# EAGLE schematic Programmer (EAGLE 7.1.0)
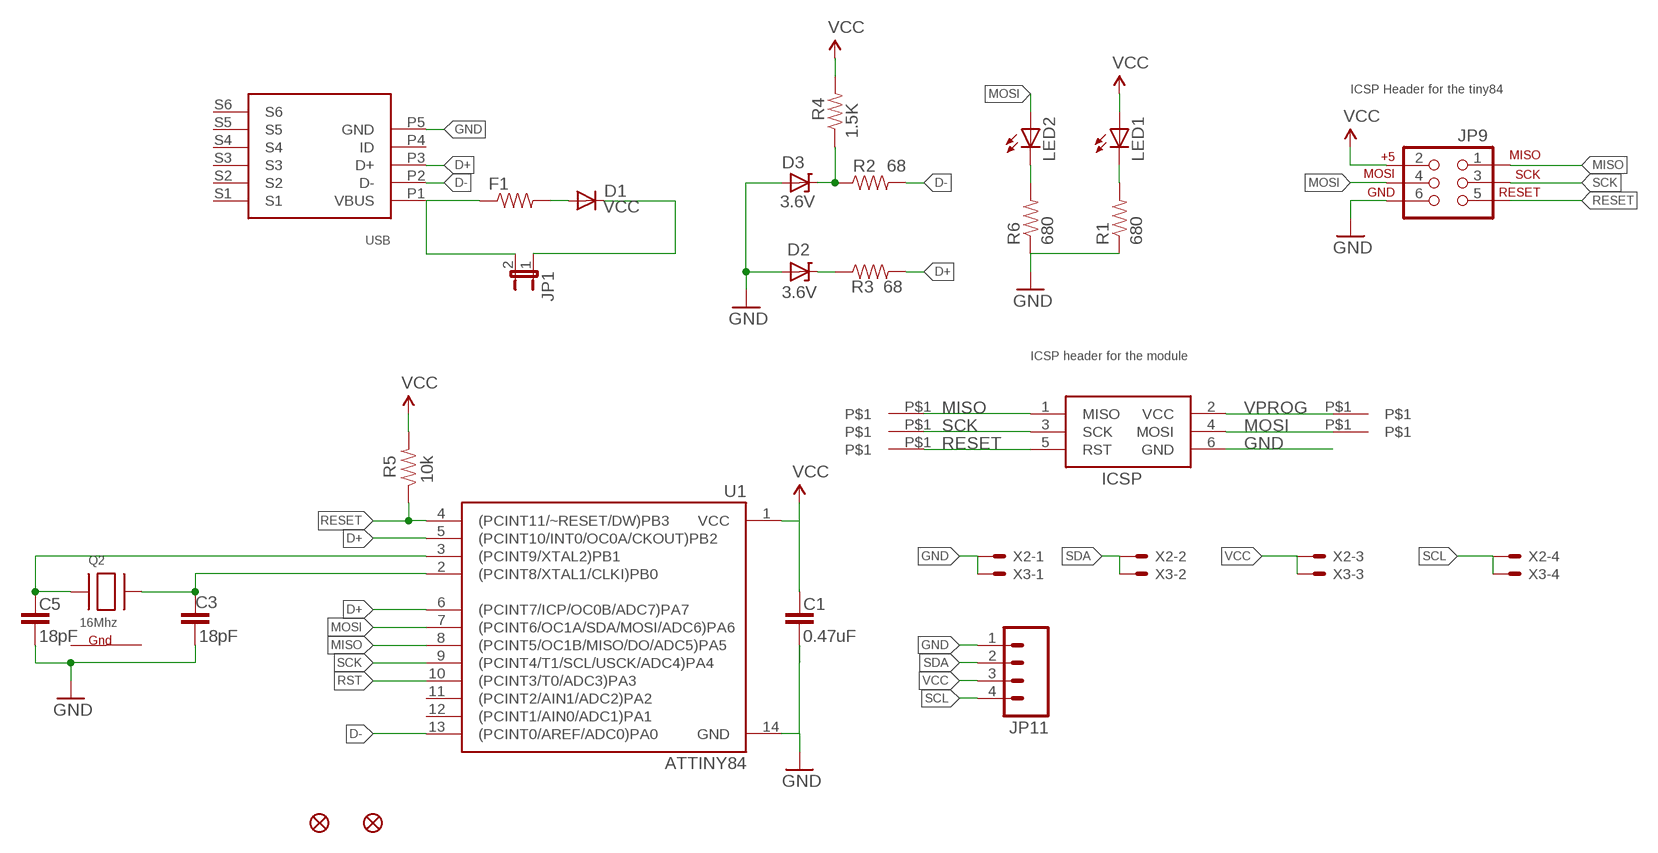
[diagram p0: schematic, sheet 1]

## Parts
C1  0.47uF  CAP0805  [0805]
C3  18pF  CAP0805  [0805]
C5  18pF  CAP0805  [0805]
D1  DIODESMB  [SMB-DIODE]
D2  3.6V  DIODE-ZENER-BZT52  [SOD-323]
D3  3.6V  DIODE-ZENER-BZT52  [SOD-323]
F1  RESISTOR0805-RES  [0805]
ICSP  AVRISP-BOX  [AVRISP-BOX]
JP1  JUMPER-2SMD-NO  [SJ_2S-NO]
JP8  FIDUCIALUFIDUCIAL  [MICRO-FIDUCIAL]
JP9  AVR_SPI_PRG_6PTH  [2X3]
JP10  FIDUCIALUFIDUCIAL  [MICRO-FIDUCIAL]
JP11  M04LOCK  [1X04_LOCK]
LED1  LEDCHIPLED_0805  [CHIPLED_0805]
LED2  LEDCHIPLED_0805  [CHIPLED_0805]
Q2  16Mhz  XTAL-4-3225  [NX3225]
R1  680  RESISTOR0805-RES  [0805]
R2  68  RESISTOR0805-RES  [0805]
R3  68  RESISTOR0805-RES  [0805]
R4  1.5K  RESISTOR0805-RES  [0805]
R5  10k  RESISTOR0402-RES  [0402-RES]
R6  680  RESISTOR0805-RES  [0805]
U1  ATTINY84  [SO14]
U$1  SPRING-CONNECTOR  [SPRING-CONNECTOR]
U$2  SPRING-CONNECTOR  [SPRING-CONNECTOR]
U$15  USBFCI-MICROB  [USB-MICROB-FCI]
U$22  SPRING-CONNECTOR  [SPRING-CONNECTOR]
U$23  SPRING-CONNECTOR  [SPRING-CONNECTOR]
U$24  SPRING-CONNECTOR  [SPRING-CONNECTOR]
X2  C-GRID-04-70543  [70543-04]
X3  C-GRID-04-70543  [70543-04]

## Nets
D+: R3.2 U1.5((PCINT10/INT0/OC0A/CKOUT)PB2) U1.6((PCINT7/ICP/OC0B/ADC7)PA7) U$15.P3(D+)
D-: R2.2 U1.13((PCINT0/AREF/ADC0)PA0) U$15.P2(D-)
GND: C1.2 C3.2 C5.2 D2.2(A) D3.2(A) ICSP.6(GND) JP9.6 JP11.1 R1.1 R6.1 U1.14(GND) U$15.P5(GND) X2.1 X3.1
MISO: ICSP.1(MISO) JP9.1 U1.8((PCINT5/OC1B/MISO/DO/ADC5)PA5) U$1.P$1
MOSI: ICSP.4(MOSI) JP9.4 LED2.A U1.7((PCINT6/OC1A/SDA/MOSI/ADC6)PA6) U$23.P$1
N$1: D1.A F1.2
N$2: LED2.C R6.2
N$3: C5.1 Q2.1(X1) U1.3((PCINT9/XTAL2)PB1)
N$5: F1.1 JP1.2 U$15.P1(VBUS)
N$6: D3.1(C) R2.1 R4.1
N$7: D2.1(C) R3.1
N$9: LED1.C R1.2
N$10: C3.1 Q2.3(X2) U1.2((PCINT8/XTAL1/CLKI)PB0)
RESET: ICSP.5(RST) JP9.5 R5.1 U1.4((PCINT11/~RESET/DW)PB3) U$2.P$1
RST: U1.10((PCINT3/T0/ADC3)PA3)
SCK: ICSP.3(SCK) JP9.3 U1.9((PCINT4/T1/SCL/USCK/ADC4)PA4) U$22.P$1
SCL: JP11.4 X2.4 X3.4
SDA: JP11.2 X2.2 X3.2
VCC: C1.1 D1.C JP1.1 JP9.2 JP11.3 LED1.A R4.2 R5.2 U1.1(VCC) X2.3 X3.3
VPROG: ICSP.2(VCC) U$24.P$1
Unconnected: U1.11((PCINT2/AIN1/ADC2)PA2) U1.12((PCINT1/AIN0/ADC1)PA1) U$15.P4(ID) U$15.S1 U$15.S2 U$15.S3 U$15.S4 U$15.S5 U$15.S6

## Notes on the sheet
- ICSP Header for the tiny84
- ICSP header for the module

## Power pins joined to a net without a drawn wire
G1: Q2.4(G1)
G2: Q2.2(G2)

## Library data of the parts
C1 C3 C5 = SparkFun-Capacitors:CAP: Capacitor Standard 0603 ceramic capacitor, and 0.1" leaded capacitor.
D1 = SparkFun-DiscreteSemi:DIODE: Diode These are standard reverse protection diodes and small signal diodes. SMA package can handle up to about 1A. SOD-323 can handle about 200mA. What the SOD-323 package when ordering, there are some mfgs out there that are 5-pin packages.; PROD_ID: DIO-09646
D2 D3 = SparkFun-DiscreteSemi:DIODE-ZENER: Zener Diode Production Part - 8199 3.4V Zener Voltage
F1 R1 R5 R6 = SparkFun-Passives:RESISTOR: Resistor Basic schematic elements and footprints for 0603, 1206, and PTH resistors.
ICSP = adafruit:AVRISP: AVR ISP HEADER Standard 6 pin header for AVR programming
JP1 = SparkFun-Passives:JUMPER-2: Jumper Basic 0.1" spaced jumper. Use with breakaway headers.
JP8 JP10 = SparkFun:FIDUCIAL: Fiducial Alignment Points Various fiducial points for machine vision alignment.
JP9 = SparkFun-Connectors:AVR_SPI_PRG_6: AVR ISP 6 Pin This is the reduced ISP connector for AVR programming. Common on Arduino. This footprint will take up less PCB space and can be used with a 10-pin to 6-pin adapter such as SKU: BOB-08508
JP11 = SparkFun-Connectors:M04: Header 4 Standard 4-pin 0.1" header. Use with straight break away headers (SKU : PRT-00116), right angle break away headers (PRT-00553), swiss pins (PRT-00743), machine pins (PRT-00117), and female headers (PRT-00115). Molex polarized connector foot print use with SKU : PRT-08231 with associated crimp pins and housings. 1MM SMD Version SKU: PRT-10208
LED1 LED2 = adafruit:LED: LED OSRAM: - CHIPLED LG R971, LG N971, LY N971, LG Q971, LY Q971, LO R971, LY R971 LH N974, LH R974 LS Q976, LO Q976, LY Q976 LO Q996 - Hyper CHIPLED LW Q18S LB Q993, LB Q99A, LB R99A - SideLED LS A670, LO A670, LY A670, LG A670, LP A670 LB A673, LV A673, LT A673, LW A673 LH A674 LY A675 LS A676, LA A676, LO A676, LY A676, LW A676 LS A679, LY A679, LG A679 - Hyper Micro SIDELED® LS Y876, LA Y876, LO Y876, LY Y876 LT Y87S - SmartLED LW L88C, LW L88S LB L89C, LB L89S, LG L890 LS L89K, LO L89K, LY L89K LS L896, LA L896, LO L896, LY L896 - TOPLED LS T670, LO T670, LY T670, LG T670, LP T670 LSG T670, LSP T670, LSY T670, LOP T670, LYG T670 LG T671, LOG T671, LSG T671 LB T673, LV T673, LT T673, LW T673 LH T674 LS T676, LA T676, LO T676, LY T676, LB T676, LH T676, LSB T676, LW T676 LB T67C, LV T67C, LT T67C, LS T67K, LO T67K, LY T67K, LW E67C LS E67B, LA E67B, LO E67B, LY E67B, LB E67C, LV E67C, LT E67C LW T67C LS T679, LY T679, LG T679 LS T770, LO T770, LY T770, LG T770, LP T770 LB T773, LV T773, LT T773, LW T773 LH T774 LS E675, LA E675, LY E675, LS T675 LS T776, LA T776, LO T776, LY T776, LB T776 LHGB T686 LT T68C, LB T68C - Hyper Mini TOPLED® LB M676 - Mini TOPLED Santana® LG M470 LS M47K, LO M47K, LY M47K Source: http://www.osram.convergy.de/
Q2 = adafruit:XTAL-4: Classic 4-pin 3.2 x 2.5mm crystal
R2-R4 = SparkFun-Resistors:RESISTOR: Resistor Basic schematic elements and footprints for 0603, 1206, and PTH resistors.
U1 = SparkFun-DigitalIC:ATTINY84: Atmel 14-pin 2/4/8kB flash uC
U$1 U$2 U$22-U$24 = IntegerLabs:SPRING-CONNECTOR
U$15 = IntegerLabs:USB
X2 X3 = con-molex:C-GRID-04: CONNECTOR wire to board 2.54 mm (0.100") pitch header; OC_FARNELL: unknown; OC_NEWARK: unknown